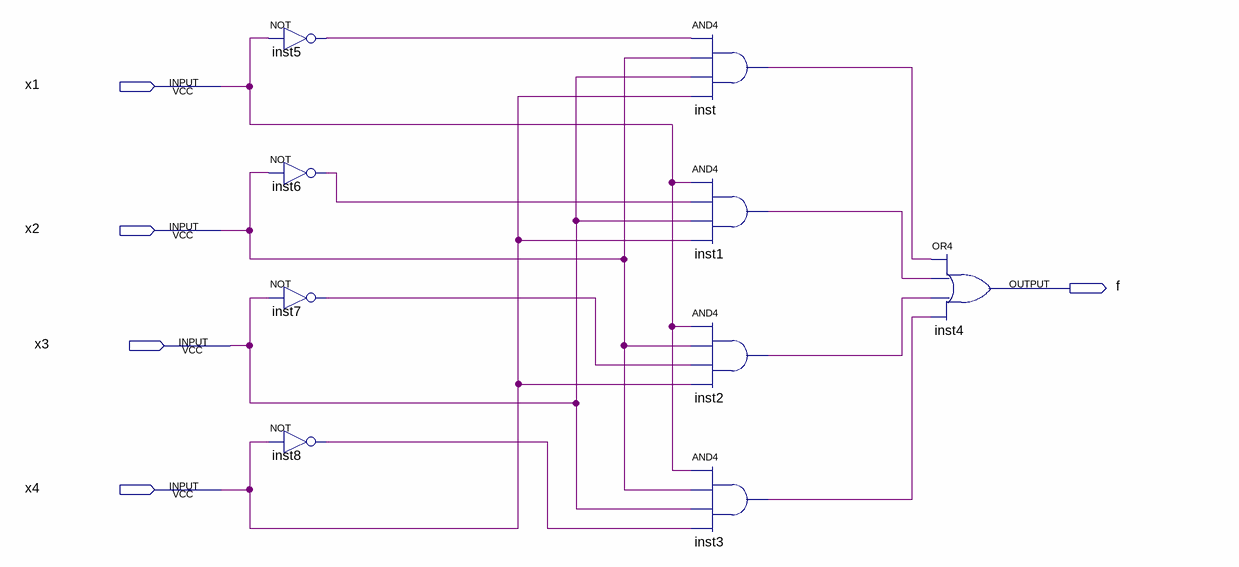
[diagram p0: schematic sheet]
// Quartus schematic prob2_diag.bdf as structural Verilog: 9 symbols, 5 pins
module prob2_diag (
  input  x1,
  input  x2,
  input  x3,
  input  x4,
  output f
);

  wire inst1_out, inst2_out, inst3_out, inst5_out, inst6_out, inst7_out, inst8_out, inst_out;

  not inst5 (inst5_out, x1);
  not inst6 (inst6_out, x2);
  not inst7 (inst7_out, x3);
  not inst8 (inst8_out, x4);
  and inst (inst_out, inst5_out, x2, x3, x4);
  and inst1 (inst1_out, x1, inst6_out, x3, x4);
  and inst2 (inst2_out, x1, x2, inst7_out, x4);
  and inst3 (inst3_out, x1, x2, x3, inst8_out);
  or inst4 (f, inst_out, inst1_out, inst2_out, inst3_out);
endmodule
